# EAGLE design MemoriaCalibrado (EAGLE 9.6.2)
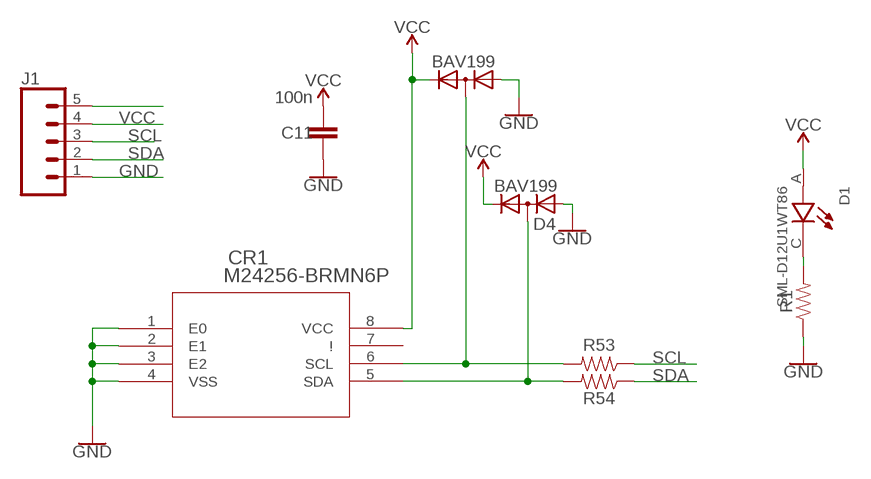
[diagram p0: schematic, sheet 1]

## Parts
C11  100n  1.0UF-0805-25V-(+80/-20%)  [0805]
CR1  M24256-BRMN6P  [SO-8_STM]
D1  SML-D12U1WT86  [LED_SML-D12U1WT86]
D4  BAV199  [SOT23]
D5  BAV199  [SOT23]
J1  CONN_05  [1X05]
R1  RESISTOR0805  [0805]
R53  RESISTOR0805  [0805]
R54  RESISTOR0805  [0805]

## Nets
GND: C11.1 CR1.1(E0) CR1.2(E1) CR1.3(E2) CR1.4(VSS) D4.1(A) D5.1(A) J1.1 R1.1
N$1: CR1.5(SDA) D4.3(AC) R54.2
N$2: D1.C R1.2
N$6: J1.5
N$36: CR1.6(SCL) D5.3(AC) R53.2
SCL: J1.3 R53.1
SDA: J1.2 R54.1
VCC: C11.2 CR1.8(VCC) D1.A D4.2(C) D5.2(C) J1.4
Unconnected: CR1.7(!)

## Library data of the parts
C11 = SparkFun-Capacitors:1.0UF: 1µF ceramic capacitors A capacitor is a passive two-terminal electrical component used to store electrical energy temporarily in an electric field.; PROD_ID: CAP-11625; VALUE: 1.0uF
CR1 = M24256:M24256-BRMN6P; COPYRIGHT: Copyright (C) 2024 Ultra Librarian. All rights reserved.; MANUFACTURER_PART_NUMBER: M24256-BRMN6P; MFR_NAME: STMicroelectronics
D1 = SML-D12U1WT86:SML-D12U1WT86: Orange 605nm LED Indication - Discrete 2.2V 0603 (1608 Metric); CHECK_PRICES: https://www.snapeda.com/parts/SML-D12U1WT86/Rohm/view-part/?ref=eda; DESCRIPTION: Red 620nm LED Indication - Discrete 2.2V 0603 (1608 Metric); DIGIKEY_PART_NUMBER: SML-D12U1WT86TR-ND; MF: Rohm; MP: SML-D12U1WT86; PACKAGE: 0603 Rohm; SNAPEDA_LINK: https://www.snapeda.com/parts/SML-D12U1WT86/Rohm/view-part/?ref=snap
D4 D5 = diode:BAV199: DIODE low-leakage double diode
J1 = SparkFun-Connectors:CONN_05: Multi connection point. Often used as Generic Header-pin footprint for 0.1 inch spaced/style header connections On any of the 0.1 inch spaced packages, you can populate with these: Break Away Headers - Straight <https://www.sparkfun.com/products/116> (PRT-00116) Break Away Male Headers - Right Angle <https://www.sparkfun.com/products/553> (PRT-00553) Female Headers <https://www.sparkfun.com/products/115> (PRT-00115) Break Away Headers - Machine Pin <https://www.sparkfun.com/products/117> (PRT-00117) Break Away Female Headers - Swiss Machine Pin <https://www.sparkfun.com/products/743> (PRT-00743) For SCREWTERMINALS and SPRING TERMINALS visit here: Screw Terimnals on SparkFun.com <https://www.sparkfun.com/search/results?term=Screw+Terminals> (5mm/3.5mm/2.54mm spacing) This device is also useful as a general connection point to wire up your design to another part of your project. Our various solder wires solder well into these plated through hole pads. Hook-Up Wire - Assortment (Stranded, 22 AWG) <https://www.sparkfun.com/products/11375> (PRT-11375) Hook-Up Wire - Assortment (Solid Core, 22 AWG) <https://www.sparkfun.com/products/11367> (PRT-11367) View the entire wire category on our website here <https://www.sparkfun.com/categories/141> Special notes: Molex polarized connector foot print use with SKU : PRT-08231 with associated crimp pins and housings. 1MM SMD Version SKU: PRT-10208
R1 R53 R54 = SparkFun-Resistors:RESISTOR: Generic Resistor Package

## Board
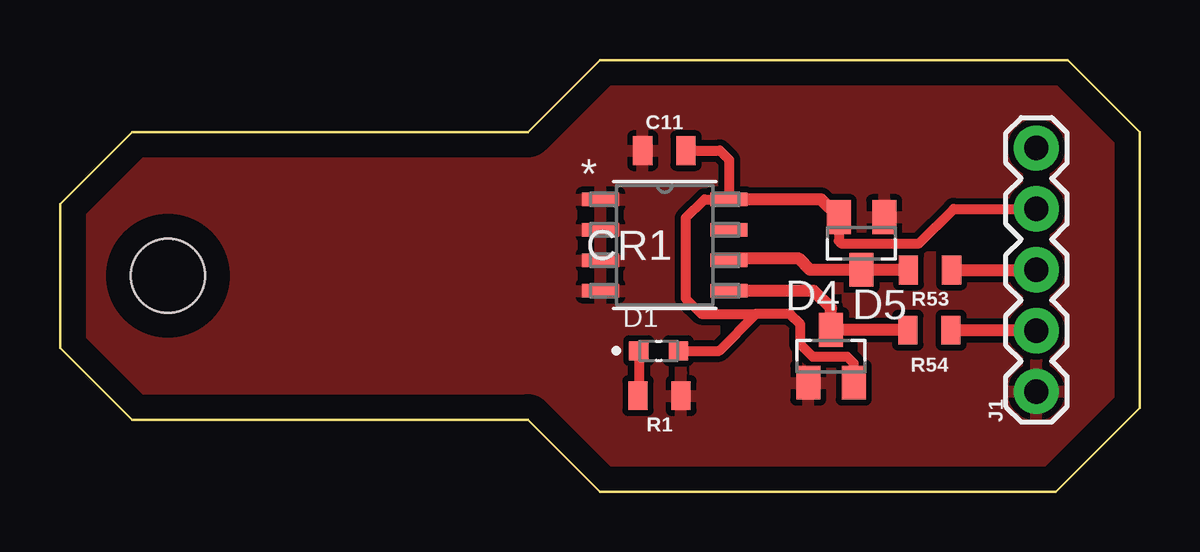
[diagram p1: board, top side]
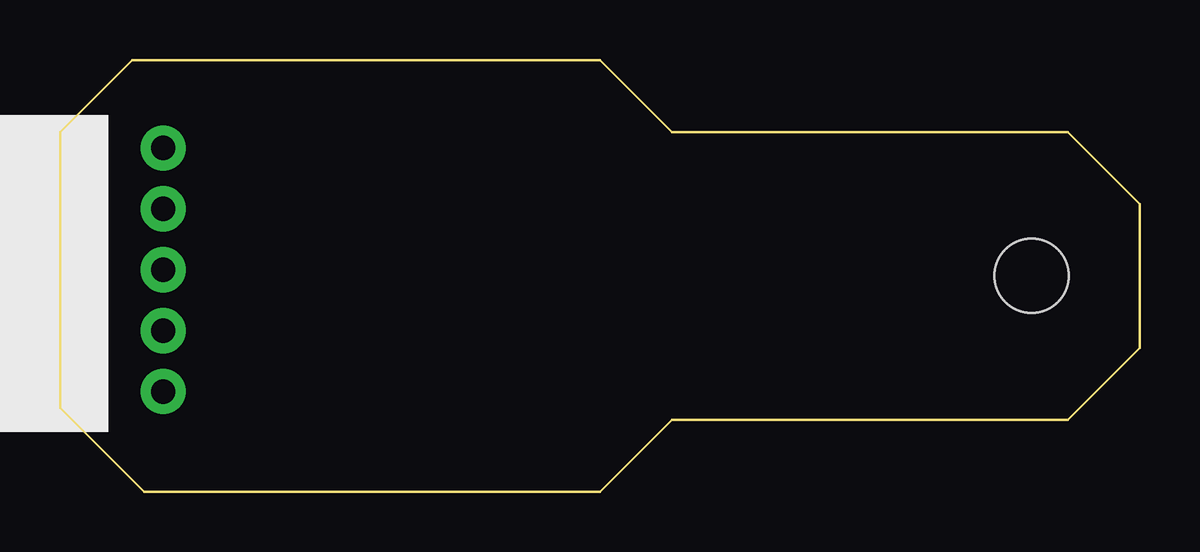
[diagram p2: board, bottom side, seen from below]

Size 45 x 18 mm. Coordinates in mm from the lower left corner, seen from the top.
Outline: 42,18 22.5,18 19.5,15 3,15 0,12 0,6 3,3 19.5,3 22.5,0 41.5,0 45,3.5 45,15 42,18
Copper layers (1*16): Top 0.035mm / dielectric 1.5mm / Bottom 0.035mm
Design rules "default": minimum track width 6mil, minimum drill 0.35mm, track to track 6mil, track to pad 6mil, pad to pad 6mil, via to via 6mil, smd to smd 6mil, copper to edge 40mil, drill to drill 6mil, minimum pad ring 10mil, minimum via ring 8mil, stop-mask expansion 4mil, vias tented up to drill 0mil, thermal gap 10mil
Holes 3.1 mm at 4.5,9

### Footprints (pad centres in the part's own frame; a part is rotated, then mirrored left to right if it is on the bottom)
0805 = smd 0.8 x 1.2: 1 -0.9,0; 2 0.9,0
SO-8_STM = smd 1.549 x 0.559: 1 -2.68,1.905; 2 -2.68,0.635; 3 -2.68,-0.635; 4 -2.68,-1.905; 5 2.68,-1.905; 6 2.68,-0.635; 7 2.68,0.635; 8 2.68,1.905
LED_SML-D12U1WT86 = smd 0.8 x 0.8: A 0.825,0; C -0.825,0
SOT23 = smd 1 x 1.4: 1 -0.95,-1.1; 2 0.95,-1.1; 3 0,1.1
1X05 = drill 1.016 pad 1.88: 1 0,0; 2 2.54,0; 3 5.08,0; 4 7.62,0; 5 10.16,0

### Placement (x,y rotation side)
C11  25.19,14.22 0 top
CR1  25.21,10.28 0 top
D1  24.95,5.87 0 top
D4  32.14,5.64 0 top
D5  33.41,10.35 180 top
J1  40.7,4.17 90 top
R1  24.99,4 180 top
R53  36.27,9.24 180 top
R54  36.24,6.73 180 top

### Tracks (layer width: path | path; a pad name or v marks a point on that pad's centre or on a via)
GND
  pour Top (isolate 0.254): -1,19 46.42,19 46.42,-1 -1,-1
N$1
  Top 0.508: R54.2 D4.3 32.14,7.65 31.41,8.38 CR1.5
N$2
  Top 0.406: D1.C 24.12,4.04 R1.2
N$36
  Top 0.508: R53.2 D5.3 31.28,9.25 30.82,9.71 27.95,9.71 CR1.6
SCL
  Top 0.508: R53.1 J1.3
SDA
  Top 0.508: J1.2 37.16,6.71 R54.1
VCC
  Top 0.406: D4.2 33.09,5.35 32.82,5.62 31.38,5.62 30.86,6.14 30.86,6.98 30.43,7.41 29.02,7.41 | D5.2 32.46,10.45 32.56,10.35 35.81,10.35 37.25,11.79 J1.4 | 29.02,7.41 26.73,7.41 26.08,8.06 26.08,11.4 26.86,12.19 CR1.8 27.89,13.84 27.51,14.22 C11.2 | D1.A 27.48,5.87 29.02,7.41
  Top 0.508: D5.2 31.73,12.19 CR1.8